# EAGLE design ad (EAGLE 9.3.0)
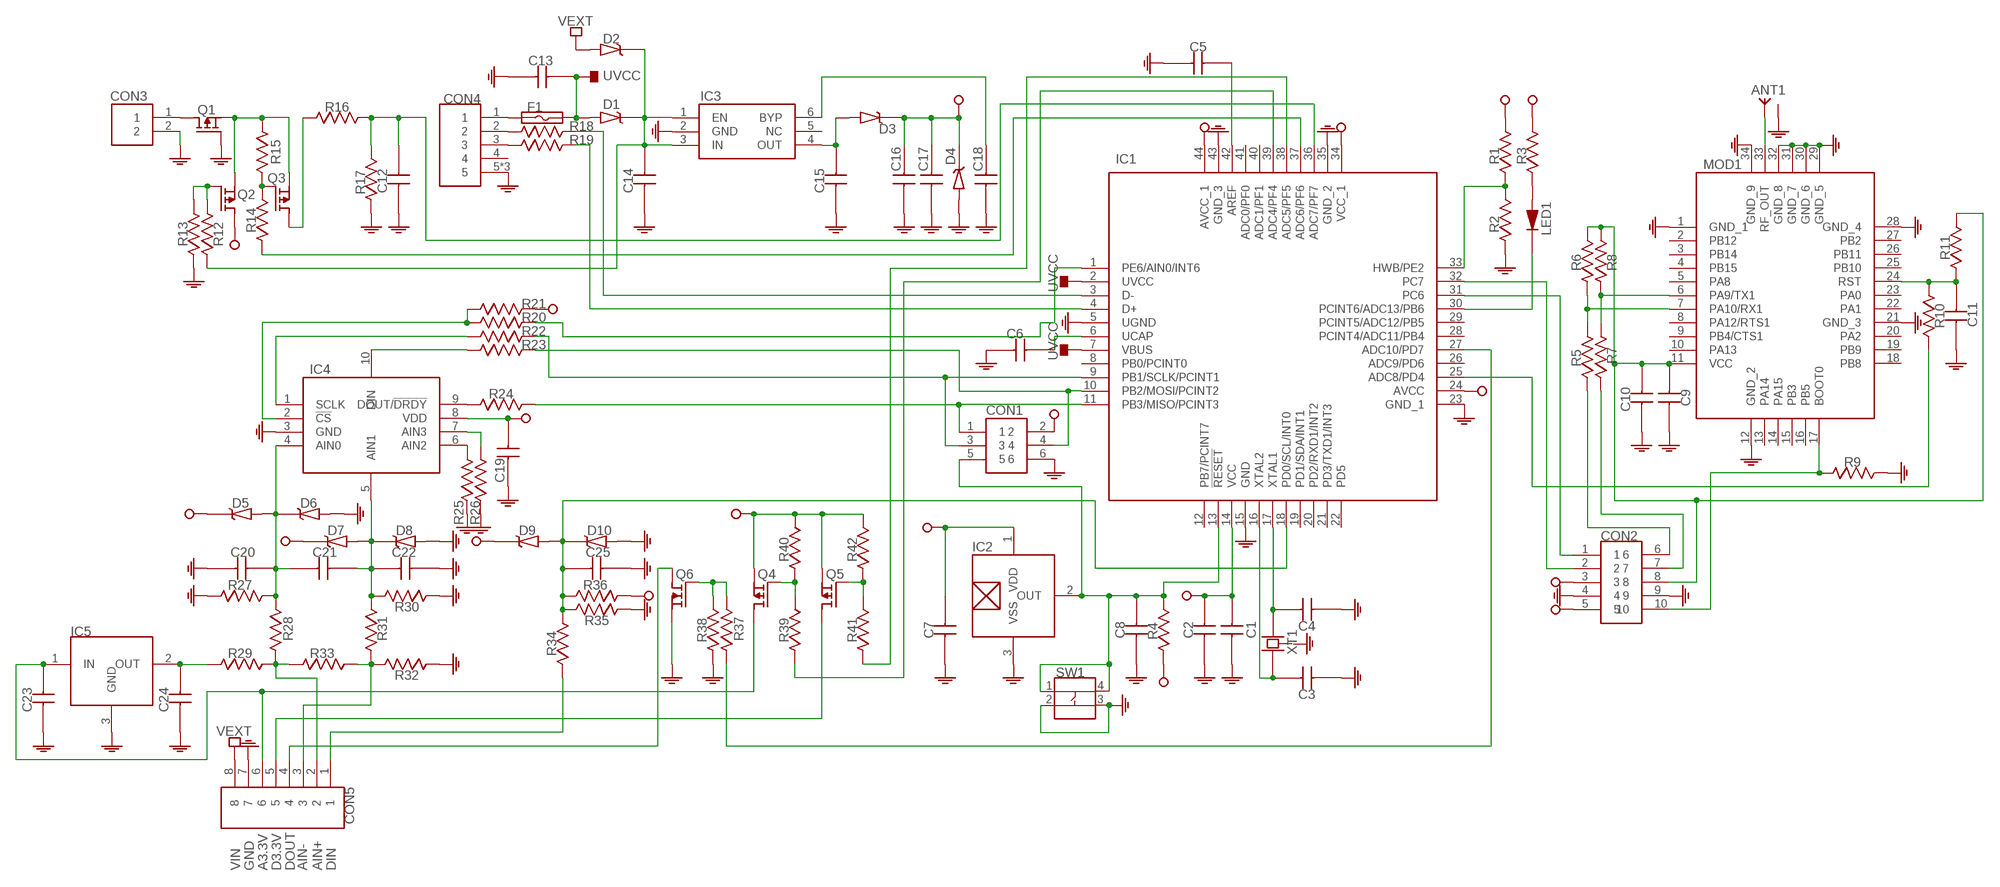
[diagram p0: schematic, sheet 1]

## Parts
ANT1  SMA-RF  [SMA-RF]
C1  CAPACITOR-0603  [0603]
C2  CAPACITOR-0603  [0603]
C3  CAPACITOR-0603  [0603]
C4  CAPACITOR-0603  [0603]
C5  CAPACITOR-0603  [0603]
C6  CAPACITOR-0603  [0603]
C7  CAPACITOR-0603  [0603]
C8  CAPACITOR-0603  [0603]
C9  CAPACITOR-0603  [0603]
C10  CAPACITOR-0603  [0603]
C11  CAPACITOR-0603  [0603]
C12  CAPACITOR-0603  [0603]
C13  CAPACITOR-0603  [0603]
C14  CAPACITOR-0805  [0805]
C15  CAPACITOR-0805  [0805]
C16  CAPACITOR-0603  [0603]
C17  CAPACITOR-0603  [0603]
C18  CAPACITOR-0603  [0603]
C19  CAPACITOR-0603  [0603]
C20  CAPACITOR-0603  [0603]
C21  CAPACITOR-0603  [0603]
C22  CAPACITOR-0603  [0603]
C23  CAPACITOR-0603  [0603]
C24  CAPACITOR-0603  [0603]
C25  CAPACITOR-0603  [0603]
CON1  ISP  [ISP]
CON2  HEADER-10P-2R-DIP-2_54MM  [HEADER-10P-2R-DIP-2_54MM]
CON3  JST-PH-2-2.0MM  [JST-PH-2-2.0MM]
CON4  USB-MICRO-DIP-VER  [USB-MICRO-DIP-VER]
CON5  CON-3_50MM-8P-1985250  [CON-3_50MM-8P-1985250]
D1  DIODE-SCHOTTKY  [SOD123-DIODE]
D2  DIODE-SCHOTTKY  [SOD123-DIODE]
D3  DIODE-SCHOTTKY  [SOD123-DIODE]
D4  ZENER-SOD123  [SOD123-DIODE]
D5  DIODE-SCHOTTKY  [SOD123-DIODE]
D6  DIODE-SCHOTTKY  [SOD123-DIODE]
D7  DIODE-SCHOTTKY  [SOD123-DIODE]
D8  DIODE-SCHOTTKY  [SOD123-DIODE]
D9  DIODE-SCHOTTKY  [SOD123-DIODE]
D10  DIODE-SCHOTTKY  [SOD123-DIODE]
F1  FUSE-0805  [0805]
IC1  ATMEGA32U4-MU  [QFN-44]
IC2  S-5712-SOT23-3  [SOT23-3]
IC3  MIC5219-VDFN-6  [VDFN-6]
IC4  ADS1118IRUGT  [X2QFN-10]
IC5  VREF-SOT23-3  [SOT23-3]
LED1  LED-0603  [LED-0603]
MOD1  RAK811  [RAK811]
Q1  P-MOSFET  [SOT23-3]
Q2  P-MOSFET  [SOT23-3]
Q3  P-MOSFET  [SOT23-3]
Q4  P-MOSFET  [SOT23-3]
Q5  P-MOSFET  [SOT23-3]
Q6  N-MOSFET  [SOT23-3]
R1  RESISTOR-0603  [0603]
R2  RESISTOR-0603  [0603]
R3  RESISTOR-0603  [0603]
R4  RESISTOR-0603  [0603]
R5  RESISTOR-0603  [0603]
R6  RESISTOR-0603  [0603]
R7  RESISTOR-0603  [0603]
R8  RESISTOR-0603  [0603]
R9  RESISTOR-0603  [0603]
R10  RESISTOR-0603  [0603]
R11  RESISTOR-0603  [0603]
R12  RESISTOR-0603  [0603]
R13  RESISTOR-0603  [0603]
R14  RESISTOR-0603  [0603]
R15  RESISTOR-0603  [0603]
R16  RESISTOR-0603  [0603]
R17  RESISTOR-0603  [0603]
R18  RESISTOR-0603  [0603]
R19  RESISTOR-0603  [0603]
R20  RESISTOR-0603  [0603]
R21  RESISTOR-0603  [0603]
R22  RESISTOR-0603  [0603]
R23  RESISTOR-0603  [0603]
R24  RESISTOR-0603  [0603]
R25  RESISTOR-0603  [0603]
R26  RESISTOR-0603  [0603]
R27  RESISTOR-JMP-2_54MM  [HEADER-2P-DIP-2_54MM]
R28  RESISTOR-JMP-2_54MM  [HEADER-2P-DIP-2_54MM]
R29  RESISTOR-JMP-2_54MM  [HEADER-2P-DIP-2_54MM]
R30  RESISTOR-JMP-2_54MM  [HEADER-2P-DIP-2_54MM]
R31  RESISTOR-JMP-2_54MM  [HEADER-2P-DIP-2_54MM]
R32  RESISTOR-JMP-2_54MM  [HEADER-2P-DIP-2_54MM]
R33  RESISTOR-JMP-2_54MM  [HEADER-2P-DIP-2_54MM]
R34  RESISTOR-JMP-2_54MM  [HEADER-2P-DIP-2_54MM]
R35  RESISTOR-JMP-2_54MM  [HEADER-2P-DIP-2_54MM]
R36  RESISTOR-JMP-2_54MM  [HEADER-2P-DIP-2_54MM]
R37  RESISTOR-0603  [0603]
R38  RESISTOR-0603  [0603]
R39  RESISTOR-0603  [0603]
R40  RESISTOR-0603  [0603]
R41  RESISTOR-0603  [0603]
R42  RESISTOR-0603  [0603]
SW1  BUTTON-4P-SMD-5X5  [BUTTON-4P-SMD-5X5]
XT1  CRYSTAL-5032-4P  [CRYSTAL-5032-4P]

## Nets
GND: ANT1.2(GND) ANT1.3(GND) ANT1.4(GND) ANT1.5(GND) C1.1 C2.1 C3.1 C4.1 C5.1 C6.1 C7.1 C8.1 C9.1 C10.1 C11.1 C12.1 C13.1 C14.1 C15.1 C16.1 C17.1 C18.1 C19.1 C20.1 C22.2 C23.1 C24.1 C25.2 CON1.6 CON2.4 CON2.9 CON3.2 CON4.5 CON4.6 CON4.7 CON5.7 D4.2(A) D6.2(A) D8.2(A) D10.2(A) IC1.5(UGND) IC1.15(GND) IC1.23(GND_1) IC1.35(GND_2) IC1.43(GND_3) IC2.3(VSS) IC3.2(GND) IC4.3(GND) IC5.3(GND) MOD1.1(GND_1) MOD1.12(GND_2) MOD1.21(GND_3) MOD1.28(GND_4) MOD1.29(GND_5) MOD1.30(GND_6) MOD1.31(GND_7) MOD1.32(GND_8) MOD1.34(GND_9) Q1.1(G) Q6.2(S) R2.1 R9.2 R13.1 R17.1 R25.1 R26.1 R27.1 R30.1 R32.1 R35.1 R38.1 SW1.2 SW1.3
N$1: IC4.1(SCLK) R22.2
N$2: C11.2 MOD1.24(RST) R10.1 R11.1
N$3: CON1.1 IC1.11(PB3/MISO/PCINT3) R24.2
N$4: ANT1.1(ANT) MOD1.33(RF_OUT)
N$6: MOD1.7(PA10/RX1) R5.2 R6.1
N$7: MOD1.6(PA9/TX1) R7.2 R8.1
N$8: IC4.2(!CS) R20.2 R21.1
N$9: CON1.4 IC1.10(PB2/MOSI/PCINT2) R23.2
N$10: C3.2 IC1.16(XTAL2) XT1.1
N$11: CON2.1 IC1.31(PC6)
N$12: C4.2 IC1.17(XTAL1) XT1.3
N$13: C9.2 C10.2 CON2.8 MOD1.11(VCC) R6.2 R8.2 R11.2
N$14: CON2.7 R7.1
N$15: Q6.1(G) R37.2 R38.2
N$16: IC1.25(ADC8/PD4) R10.2
N$17: IC4.10(DIN) R23.1
N$18: IC4.9(DOUT/!DRDY) R24.1
N$19: IC1.30(PCINT6/ADC13/PB6) LED1.1(K)
N$20: CON5.2 R28.2 R29.2 R33.1
N$21: CON5.3 R31.2 R32.2 R33.2
N$22: C25.1 D9.2(A) D10.1(K) IC1.18(PD0/SCL/INT0) R34.2 R35.2 R36.2
N$23: C21.2 C22.1 D7.2(A) D8.1(K) IC4.5(AIN1) R30.2 R31.1
N$24: C20.2 C21.1 D5.2(A) D6.1(K) IC4.4(AIN0) R27.2 R28.1
N$25: CON5.4 Q6.3(D)
N$26: IC1.27(ADC10/PD7) R37.1
N$27: CON5.5 Q5.3(D)
N$28: Q5.1(G) R41.2 R42.1
N$29: CON2.2 IC1.32(PC7)
N$30: IC4.6(AIN2) R25.2
N$31: C5.2 IC1.42(AREF)
N$32: Q3.1(G) R14.2 R15.2
N$33: CON4.1 F1.1
N$34: C6.2 IC1.6(UCAP)
N$35: LED1.2(A) R3.1
N$36: C12.2 IC1.36(ADC7/PF7) R16.2 R17.2
N$37: C18.2 IC3.6(BYP)
N$38: C14.2 D1.1(K) D2.1(K) IC3.1(EN) IC3.3(IN) R12.1
N$40: C15.2 D3.2(A) IC3.4(OUT)
N$41: CON4.2 R18.1
N$42: CON4.3 R19.1
N$43: IC1.3(D-) R18.2
N$44: IC1.4(D+) R19.2
N$45: CON1.3 IC1.9(PB1/SCLK/PCINT1) R22.1
N$46: Q4.1(G) R39.2 R40.1
N$47: IC1.37(ADC6/PF6) R14.1
N$48: IC1.1(PE6/AIN0/INT6) R20.1
N$50: IC1.38(ADC5/PF5) R41.1
N$51: IC1.39(ADC4/PF4) R39.1
N$52: CON5.1 R34.1
N$53: Q2.1(G) R12.2 R13.2
N$54: IC4.7(AIN3) R26.2
N$55: CON3.1 Q1.3(D)
N$56: C24.2 IC5.2(OUT) R29.1
N$57: C23.2 CON5.6 IC5.1(IN) Q4.3(D)
N$58: Q1.2(S) Q2.2(S) Q3.2(S) R15.1
N$59: Q3.3(D) R16.1
N$60: CON2.6 R5.1
N$61: IC1.33(HWB/PE2) R1.1 R2.2
N$63: CON2.10 MOD1.17(BOOT0) R9.1
N$64: C8.2 CON1.5 IC1.13(!RESET) IC2.2(OUT) R4.2 SW1.1 SW1.4
UVCC: C13.2 D1.2(A) F1.2 IC1.2(UVCC) IC1.7(VBUS)
VCC: C1.2 C2.2 C7.2 C16.2 C17.2 C19.2 CON1.2 CON2.3 CON2.5 D3.1(K) D4.1(K) D5.1(K) D7.1(K) D9.1(K) IC1.14(VCC) IC1.24(AVCC) IC1.34(VCC_1) IC1.44(AVCC_1) IC2.1(VDD) IC4.8(VDD) Q2.3(D) Q4.2(S) Q5.2(S) R1.2 R3.2 R4.1 R21.2 R36.1 R40.2 R42.2
VEXT: CON5.8 D2.2(A)
Unconnected: CON4.4 IC1.8(PB0/PCINT0) IC1.12(PB7/PCINT7) IC1.19(PD1/SDA/INT1) IC1.20(PD2/RXD1/INT2) IC1.21(PD3/TXD1/INT3) IC1.22(PD5) IC1.26(ADC9/PD6) IC1.28(PCINT4/ADC11/PB4) IC1.29(PCINT5/ADC12/PB5) IC1.40(ADC1/PF1) IC1.41(ADC0/PF0) IC3.5(NC) MOD1.2(PB12) MOD1.3(PB14) MOD1.4(PB15) MOD1.5(PA8) MOD1.8(PA12/RTS1) MOD1.9(PB4/CTS1) MOD1.10(PA13) MOD1.13(PA14) MOD1.14(PA15) MOD1.15(PB3) MOD1.16(PB5) MOD1.18(PB8) MOD1.19(PB9) MOD1.20(PA2) MOD1.22(PA1) MOD1.23(PA0) MOD1.25(PB10) MOD1.26(PB11) MOD1.27(PB2)

## Notes on the sheet
- VIN | GND | A3.3V | D3.3V | DOUT | AIN- | AIN+ | DIN

## Power pins joined to a net without a drawn wire
GND: XT1.2(GND) XT1.4(GND)

## Library data of the parts
ANT1 = SamacSys_Parts:SMA-RF
C1-C13 C16-C25 = SamacSys_Parts:CAPACITOR-0603
C14 C15 = SamacSys_Parts:CAPACITOR-0805
CON1 = SamacSys_Parts:ISP
CON2 = SamacSys_Parts:HEADER-10P-2R-DIP-2_54MM
CON3 = SamacSys_Parts:JST-PH-2-2.0MM
CON4 = SamacSys_Parts:USB-MICRO-DIP-VER
CON5 = SamacSys_Parts:CON-3_50MM-8P-1985250
D1-D3 D5-D10 = SamacSys_Parts:DIODE-SCHOTTKY
D4 = SamacSys_Parts:ZENER-SOD123
F1 = SamacSys_Parts:FUSE-0805
IC1 = SamacSys_Parts:ATMEGA32U4-MU
IC2 = SamacSys_Parts:S-5712-SOT23-3
IC3 = SamacSys_Parts:MIC5219-VDFN-6
IC4 = SamacSys_Parts:ADS1118IRUGT
IC5 = SamacSys_Parts:VREF-SOT23-3
LED1 = SamacSys_Parts:LED-0603
MOD1 = SamacSys_Parts:RAK811
Q1-Q5 = SamacSys_Parts:P-MOSFET
Q6 = SamacSys_Parts:N-MOSFET
R1-R26 R37-R42 = SamacSys_Parts:RESISTOR-0603
R27-R36 = SamacSys_Parts:RESISTOR-JMP-2_54MM
SW1 = SamacSys_Parts:BUTTON-4P-SMD-5X5
XT1 = SamacSys_Parts:CRYSTAL-5032-4P

## Board
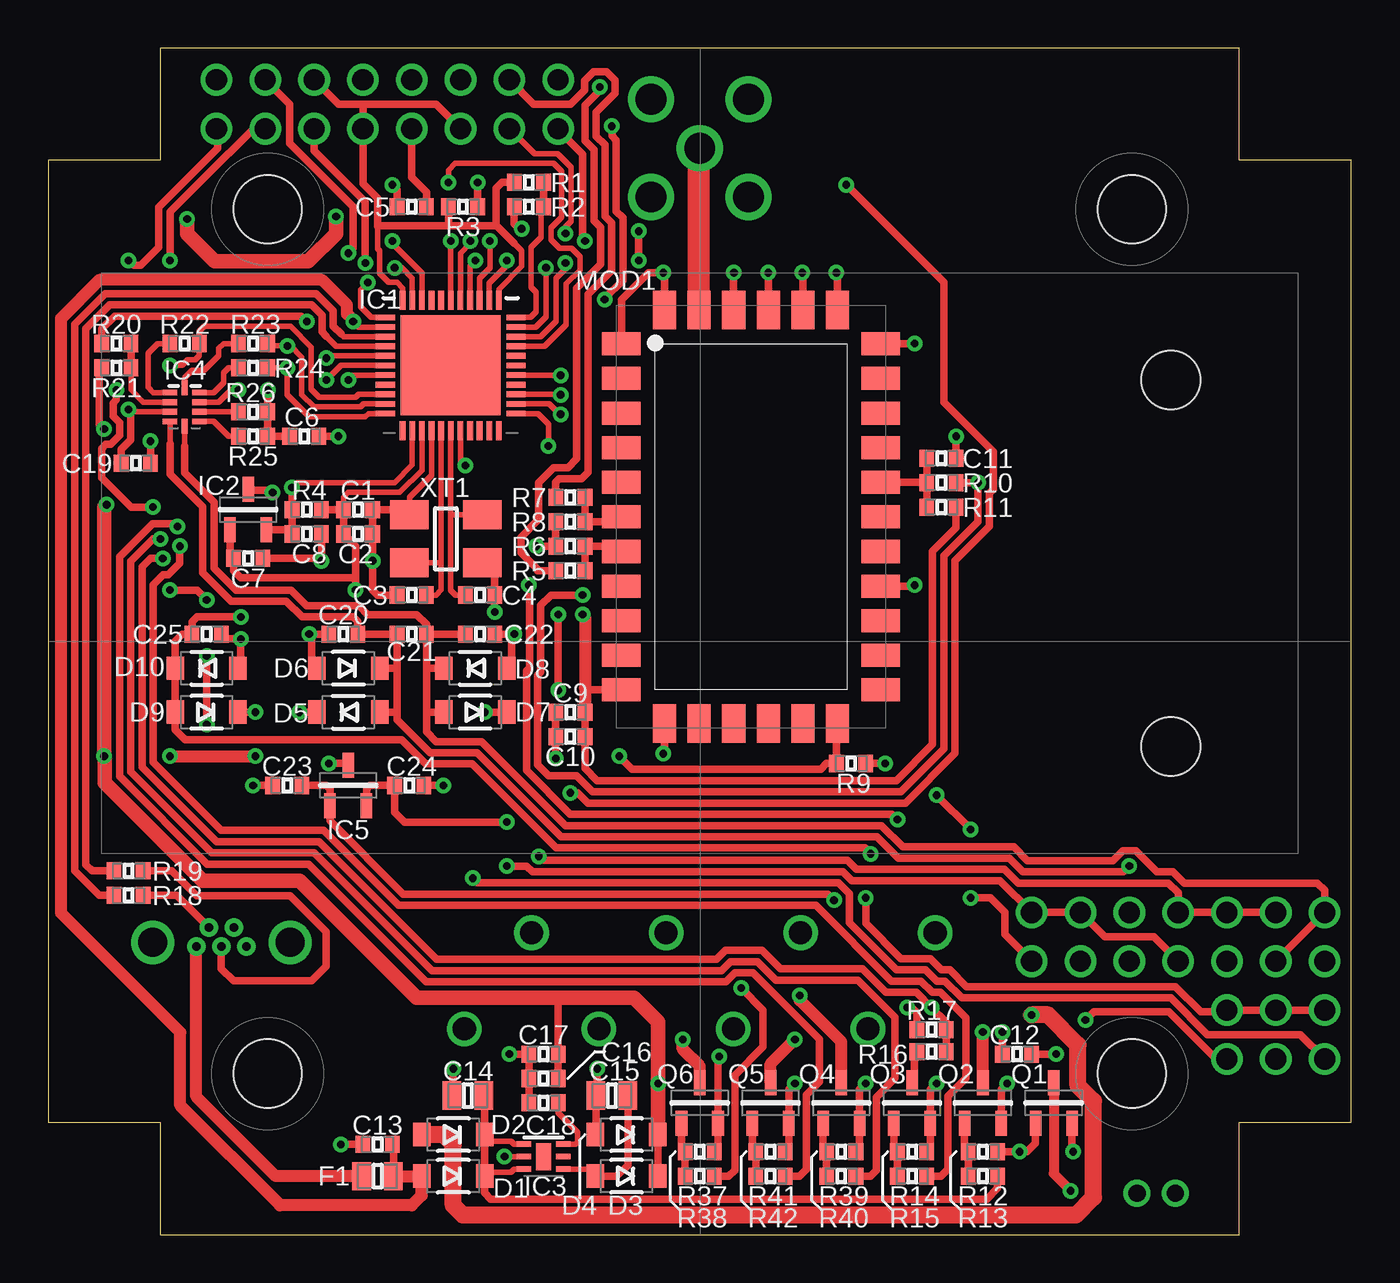
[diagram p1: board, top side]
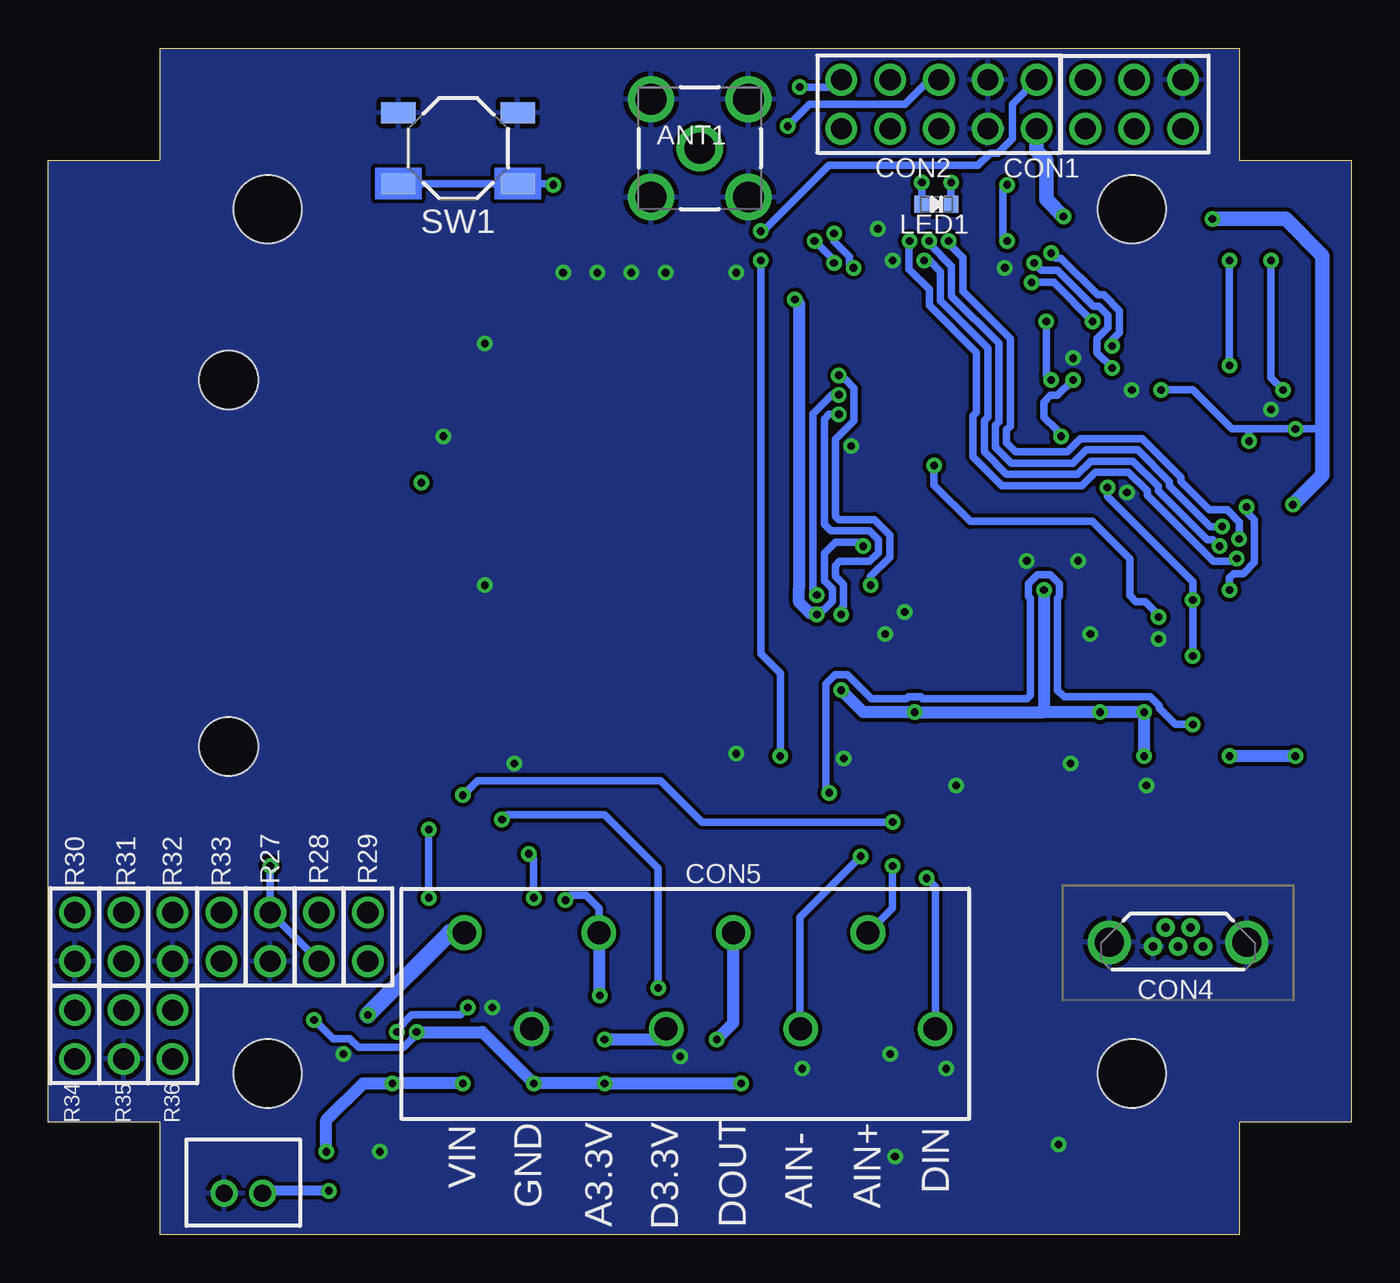
[diagram p2: board, bottom side, seen from below]

Size 67.82 x 61.72 mm. Coordinates in mm from the lower left corner, seen from the top.
Outline: 0,5.84 5.84,5.84 5.84,0 61.98,0 61.98,5.84 67.82,5.84 67.82,55.88 61.98,55.88 61.98,61.72 5.84,61.72 5.84,55.88 0,55.88 0,5.84
Copper layers (1*16): Top 0.035mm / dielectric 1.5mm / Bottom 0.035mm
Design rules "qfn": minimum track width 10mil, minimum drill 0.4mm, track to track 8mil, track to pad 10mil, pad to pad 8mil, via to via 8mil, smd to smd 0mil, copper to edge 0mil, drill to drill 6mil, minimum pad ring 10mil, minimum via ring 8mil, stop-mask expansion 4mil, vias tented up to drill 25mil, thermal gap 10mil
Holes 3.56 mm at 11.43,8.38 56.39,8.38 56.39,53.34 11.43,53.34
Holes 3.05 mm at 58.42,44.45 58.42,25.4
bRestrict: area 21.3,52.8 to 21.8,55

### Footprints (pad centres in the part's own frame; a part is rotated, then mirrored left to right if it is on the bottom)
SMA-RF = drill 1.6: 1 0,0; 2 -2.54,2.54; 3 -2.54,-2.54; 4 2.54,-2.54; 5 2.54,2.54
0603 = smd 0.762 x 0.889: 1 -0.762,0; 2 0.762,0
0805 = smd 0.97 x 1.47: 1 -0.83,0; 2 0.83,0
ISP = drill 1.1 pad 1.65: 1 0,0; 2 2.54,0; 3 0,-2.54; 4 2.54,-2.54; 5 0,-5.08; 6 2.54,-5.08
HEADER-10P-2R-DIP-2_54MM = drill 1.1 pad 1.65: 1 0,0; 2 2.54,0; 3 5.08,0; 4 7.62,0; 5 10.16,0; 6 0,2.54; 7 2.54,2.54; 8 5.08,2.54; 9 7.62,2.54; 10 10.16,2.54
JST-PH-2-2.0MM = drill 0.9: 1 -1,0; 2 1,0
USB-MICRO-DIP-VER = drill 0.45: 1 -1.3,0; 2 -0.65,-1; 3 0,0; 4 0.65,-1; 5 1.3,0 | drill 1.5: 6 -3.575,-0.22; 7 3.575,-0.22
CON-3_50MM-8P-1985250 = drill 1.2: 1 12.25,-2.5; 2 8.75,2.5; 3 5.25,-2.5; 4 1.75,2.5; 5 -1.75,-2.5; 6 -5.25,2.5; 7 -8.75,-2.5; 8 -12.25,2.5
SOD123-DIODE = smd 0.91 x 1.22: 1 -1.635,0; 2 1.635,0
QFN-44 = smd 1 x 0.3: 1 -3.4,2.5; 2 -3.4,2; 3 -3.4,1.5; 4 -3.4,1; 5 -3.4,0.5; 6 -3.4,0; 7 -3.4,-0.5; 8 -3.4,-1; 9 -3.4,-1.5; 10 -3.4,-2; 11 -3.4,-2.5; 23 3.4,-2.5; 24 3.4,-2; 25 3.4,-1.5; 26 3.4,-1; 27 3.4,-0.5; 28 3.4,0; 29 3.4,0.5; 30 3.4,1; 31 3.4,1.5; 32 3.4,2; 33 3.4,2.5 | smd 0.3 x 1: 12 -2.5,-3.4; 13 -2,-3.4; 14 -1.5,-3.4; 15 -1,-3.4; 16 -0.5,-3.4; 17 0,-3.4; 18 0.5,-3.4; 19 1,-3.4; 20 1.5,-3.4; 21 2,-3.4; 22 2.5,-3.4; 34 2.5,3.4; 35 2,3.4; 36 1.5,3.4; 37 1,3.4; 38 0.5,3.4; 39 0,3.4; 40 -0.5,3.4; 41 -1,3.4; 42 -1.5,3.4; 43 -2,3.4; 44 -2.5,3.4 | smd 5.2 x 5.2: 45 0,0
SOT23-3 = smd 1.3 x 0.6: 1 -1.05,0.95; 2 -1.05,-0.95; 3 1.05,0
VDFN-6 = smd 0.75 x 0.3: 1 -1.025,0.65; 2 -1.025,0; 3 -1.025,-0.65; 4 1.025,-0.65; 5 1.025,0; 6 1.025,0.65 | smd 0.8 x 1.4: 7 0,0
X2QFN-10 = smd 0.75 x 0.3: 1 -0.775,0.75; 2 -0.775,0.25; 3 -0.775,-0.25; 4 -0.775,-0.75; 6 0.775,-0.75; 7 0.775,-0.25; 8 0.775,0.25; 9 0.775,0.75 | smd 0.3 x 0.8: 5 0,-1; 10 0,1
LED-0603 = smd 0.762 x 0.889: 1 -0.762,0; 2 0.762,0
RAK811 = smd 2 x 1.2: 1 -6.75,9; 2 -6.75,7.2; 3 -6.75,5.4; 4 -6.75,3.6; 5 -6.75,1.8; 6 -6.75,0; 7 -6.75,-1.8; 8 -6.75,-3.6; 9 -6.75,-5.4; 10 -6.75,-7.2; 11 -6.75,-9; 18 6.75,-9; 19 6.75,-7.2; 20 6.75,-5.4; 21 6.75,-3.6; 22 6.75,-1.8; 23 6.75,0; 24 6.75,1.8; 25 6.75,3.6; 26 6.75,5.4; 27 6.75,7.2; 28 6.75,9 | smd 1.2 x 2: 12 -4.5,-10.75; 13 -2.7,-10.75; 14 -0.9,-10.75; 15 0.9,-10.75; 16 2.7,-10.75; 17 4.5,-10.75; 29 4.5,10.75; 30 2.7,10.75; 31 0.9,10.75; 32 -0.9,10.75; 33 -2.7,10.75; 34 -4.5,10.75
HEADER-2P-DIP-2_54MM = drill 1.1 pad 1.65: 1 0,-1.27; 2 0,1.27
BUTTON-4P-SMD-5X5 = smd 1.8 x 1.1: 1 -3.1,1.85; 2 -3.1,-1.85; 3 3.1,-1.85; 4 3.1,1.85
CRYSTAL-5032-4P = smd 2 x 1.5: 1 -1.9,-1.25; 2 1.9,-1.25; 3 1.9,1.25; 4 -1.9,1.25

### Placement (x,y rotation side)
ANT1  33.91,56.52 0 bottom
C1  16.13,37.72 180 top
C2  16.13,36.45 180 top
C3  18.92,33.27 0 top
C4  22.48,33.27 180 top
C5  18.92,53.47 180 top
C6  13.34,41.53 0 top
C7  10.41,35.18 180 top
C8  13.46,36.45 180 top
C9  27.18,27.18 0 top
C10  27.18,25.91 0 top
C11  46.48,40.39 180 top
C12  50.42,9.4 180 top
C13  17.14,4.7 0 top
C14  21.84,7.24 0 top
C15  29.34,7.24 0 top
C16  25.78,8.13 0 top
C17  25.78,9.4 0 top
C18  25.78,6.86 0 top
C19  4.57,40.13 0 top
C20  15.37,31.24 0 top
C21  18.92,31.24 0 top
C22  22.48,31.24 0 top
C23  12.45,23.37 0 top
C24  18.8,23.37 180 top
C25  8.26,31.24 0 top
CON1  13.84,57.53 90 bottom
CON2  26.54,57.53 0 bottom
CON3  57.66,2.16 180 bottom
CON4  9.02,14.99 180 bottom
CON5  33.91,13.21 0 bottom
D1  21.08,3.05 180 top
D2  21.08,5.21 180 top
D3  30.1,3.05 180 top
D4  30.1,5.21 180 top
D5  15.62,27.18 0 top
D6  15.62,29.46 180 top
D7  22.23,27.18 180 top
D8  22.23,29.46 0 top
D9  8.26,27.18 180 top
D10  8.26,29.46 0 top
F1  17.14,3.05 0 top
IC1  20.95,45.21 0 top
IC2  10.41,37.72 90 top
IC3  25.78,4.06 0 top
IC4  7.11,43.05 0 top
IC5  15.62,23.37 90 top
LED1  21.59,53.59 180 bottom
MOD1  36.58,37.34 0 top
Q1  52.32,6.86 90 top
Q2  48.64,6.86 90 top
Q3  44.96,6.86 90 top
Q4  41.27,6.86 90 top
Q5  37.59,6.86 90 top
Q6  33.91,6.86 90 top
R1  25.02,54.74 180 top
R2  25.02,53.47 0 top
R3  21.59,53.47 180 top
R4  13.46,37.72 180 top
R5  27.18,34.54 0 top
R6  27.18,35.81 180 top
R7  27.18,38.35 0 top
R8  27.18,37.08 180 top
R9  41.78,24.51 0 top
R10  46.48,39.12 0 top
R11  46.48,37.85 0 top
R12  48.64,3.05 180 top
R13  48.64,4.32 180 top
R14  44.96,3.05 180 top
R15  44.96,4.32 180 top
R16  45.97,9.53 0 top
R17  45.97,10.67 0 top
R18  4.19,17.65 180 top
R19  4.19,18.92 180 top
R20  3.56,46.35 0 top
R21  3.56,45.09 180 top
R22  7.11,46.35 180 top
R23  10.67,46.35 0 top
R24  10.67,45.09 0 top
R25  10.67,41.53 180 top
R26  10.67,42.8 180 top
R27  56.26,15.49 0 bottom
R28  53.72,15.49 0 bottom
R29  51.18,15.49 0 bottom
R30  66.42,15.49 0 bottom
R31  63.88,15.49 0 bottom
R32  61.34,15.49 0 bottom
R33  58.8,15.49 0 bottom
R34  66.42,10.41 0 bottom
R35  63.88,10.41 0 bottom
R36  61.34,10.41 0 bottom
R37  33.91,3.05 180 top
R38  33.91,4.32 180 top
R39  41.27,3.05 180 top
R40  41.27,4.32 0 top
R41  37.59,3.05 180 top
R42  37.59,4.32 0 top
SW1  46.48,56.52 180 bottom
XT1  20.7,36.2 0 top

### Tracks (layer width: path | path; a pad name or v marks a point on that pad's centre or on a via)
GND  (via drill 0.4)
  Top 0.292: IC3.2 v23.75,4.06 | IC1.15 19.95,39.51 18.8,38.36 18.8,37.72 XT1.4 | IC4.3 4.31,42.8 v4.19,42.93 | IC1.5 14.6,45.71 v14.48,45.59 | IC1.35 22.95,49.5 23.88,50.42 v23.88,50.67 | IC1.43 18.95,49.75 18.41,50.29 v18.03,50.29 | IC1.23 25.49,42.71 26.04,42.16 v26.04,41.02
  Top 0.381: D4.2 28.51,5.25 C15.1 28.57,7.31 v28.57,8.64 | C18.1 C16.1 C17.1 v24,9.4 | C14.1 21.08,7.31 v21.08,8.64 | R13.1 v50.55,4.32 50.93,4.32 51.37,4.76 Q1.1 | R38.1 34.86,4.51 Q6.2 34.86,9.21 v34.92,9.27 | C25.2 9.27,30.99 v10.03,30.99 10.03,29.61 D10.2 | C20.1 v13.59,31.24 13.72,31.11 13.72,29.73 D6.2 | C22.2 v24.26,31.24 24.13,31.11 24.13,29.73 D8.2 | XT1.2 22.91,35.26 23.24,34.92 C4.1 v23.24,32.38 | 18.8,37.72 C1.1 C2.1 v16.89,35.05 16.89,33.53 17.14,33.27 C3.1 | C8.1 v14.22,35.05 14.1,35.18 C7.1 | MOD1.34 32.08,49.97 v32,50.04 31.24,50.04 29.83,48.62 MOD1.1 | MOD1.32 35.68,50.03 v35.69,50.04 | MOD1.31 37.48,50.03 v37.47,50.04 | MOD1.30 39.28,50.01 v39.24,50.04 | MOD1.29 41.08,49.98 v41.02,50.04 | MOD1.28 45.07,46.34 v45.09,46.35 | MOD1.21 45.04,33.74 v45.09,33.78 | MOD1.12 32.08,25.09 v32,25.02 | v11.43,43.94 R26.1 R25.1 C6.1 | v11.68,38.61 11.56,38.73 10.45,38.73 IC2.3 | C11.1 v47.24,41.53 | C9.1 C10.1 v26.42,24.77 | R9.2 v43.56,24.51 | C5.1 19.68,54.23 18.92,54.99 CON2.4 | R2.1 24.26,52.58 24.51,52.32 v24.64,52.32 | C19.1 3.81,40.85 4.3,41.34 4.3,42.81 v4.19,42.93 | C12.1 v52.45,9.4 | v44.7,11.81 44.96,11.81 45.21,11.56 R17.1 | C23.1 v10.67,23.37 | C24.1 v20.57,23.37 | IC5.3 15.53,24.51 v14.61,24.51 | C13.1 v15.24,4.7
  pour Bottom: 0.13,5.97 0.13,55.75 5.97,55.75 5.97,61.59 61.85,61.59 61.85,55.75 67.69,55.75 67.69,5.97 61.85,5.97 61.85,0.13 5.97,0.13 5.97,5.97
N$1
  Top 0.292: IC4.1 5.47,43.8 5.21,44.07 5.21,45.85 5.71,46.35 R22.2
N$2
  Top 0.381: C11.2 R10.1 | R10.1 R11.1 | MOD1.24 45.7,39.14 R10.1
N$3  (via drill 0.4)
  Top 0.292: R24.2 v12.45,45.09 12.45,43.69 13.59,42.55 16.51,42.55 16.68,42.71 IC1.11
  Top 0.381: CON1.1 13.84,56.39 16.51,53.72 v16.51,50.55
  Bottom 0.381: v12.45,45.09 13.24,45.88 13.24,46.59 12.66,47.17 12.66,47.83 13.13,48.3 13.43,48.3 15.3,50.16 16.13,50.16 v16.51,50.55
N$4
  Top 1.143: MOD1.33 33.88,56.48 ANT1.1
N$6
  Top 0.381: MOD1.7 29.55,35.81 R6.1 R5.2
N$7
  Top 0.381: MOD1.6 29.57,37.08 R8.1 R7.2
N$8
  Top 0.292: IC4.2 4.96,43.3 4.32,43.94 R21.1
  Top 0.381: R20.2 R21.1
N$9  (via drill 0.4)
  Top 0.292: R23.2 11.56,46.23 v12.45,46.23 12.62,46.23 13.2,45.65 13.2,43.7 13.84,43.05 16.26,43.05 16.41,43.21 IC1.10
  Top 0.381: v15.62,51.05 15.88,51.31 15.88,53.47 12.57,56.77 12.57,58.8 CON1.4
  Bottom 0.381: v12.45,46.23 12.45,46.56 12.08,46.93 12.08,48.07 12.89,48.88 13.19,48.88 15.11,50.8 15.37,50.8 v15.62,51.05
N$10
  Top 0.292: IC1.16 20.45,34.92 | 20.45,34.92 20.45,33.54 20.19,33.27 C3.2 | XT1.1 20.43,34.95 20.45,34.92
N$11  (via drill 0.4)
  Top 0.292: IC1.31 25.63,46.71 26.43,47.51 26.43,49.75 26.92,50.24 v26.92,50.55
  Top 0.381: v27.94,51.69 27.94,51.74 27.81,51.86 27.81,56.2 26.54,57.47 CON2.1
  Bottom 0.381: v26.92,50.55 26.92,50.67 v27.94,51.69
N$12
  Top 0.292: C4.2 21.21,33.27 20.95,33.53 20.95,37.47 | IC1.17 20.95,37.47 | XT1.3 20.98,37.45 20.95,37.47
N$13  (via drill 0.4)
  Top 0.381: C9.2 C10.2 27.94,24.26 28.57,23.62 44.13,23.62 46.02,25.52 46.02,35.55 47.24,36.77 R11.2 | R8.2 R6.2 v25.4,35.81 | v28.96,48.64 28.96,48.7 29.91,49.65 29.91,52.88 29.57,53.22 29.57,56.92 29.34,57.15 v29.34,57.66 | MOD1.11 28.05,28.34 27.94,28.45
  Top 0.635: v27.81,32.26 27.94,32.13 27.94,28.45 C9.2
  Bottom 0.381: v29.34,57.66 28.19,58.8 23.24,58.8 21.97,60.07 CON2.8 | v27.81,32.26 27.59,32.48 27.48,32.48 27.02,32.94 27.02,33.6 27.43,34.02 27.43,35.43 26.84,36.03 25.61,36.03 v25.4,35.81
  Bottom 0.635: v27.81,32.26 27.91,32.35 28.2,32.35 28.74,32.89 28.74,33.66 28.73,33.67 28.73,48.41 v28.96,48.64
N$14
  Top 0.381: CON2.7 25.27,58.8 27.18,58.8 27.91,59.53 27.91,60.02 28.37,60.49 29.05,60.49 29.5,60.04 29.5,59.36 28.52,58.38 28.52,57.14 28.98,56.68 28.98,52.98 29.32,52.64 29.32,50.15 28.09,48.92 28.09,39.65 27.76,39.31 26.6,39.31 26.42,39.13 R7.1
N$15
  Top 0.381: Q6.1 32.96,4.51 R38.2 R37.2
N$16  (via drill 0.4)
  Top 0.292: v26.67,43.69 26.65,43.71 IC1.25
  Top 0.381: R10.2 v48.39,39.12 48.39,37.08 46.61,35.31 46.61,25.27 44.37,23.04 28.33,23.04 27.5,23.88 26.05,23.88 25.47,24.46 25.47,29.09 25.64,29.26 25.64,32.75 26.16,33.27 v27.81,33.27
  Bottom 0.381: v27.81,33.27 28.02,33.48 28.02,42.71 27.04,43.69 v26.67,43.69
N$17
  Top 0.292: IC4.10 7.11,44.58 7.49,44.96 8.13,44.96 8.89,45.72 8.89,46.1 9.14,46.35 R23.1
N$18
  Top 0.292: IC4.9 8.62,43.8 9.14,44.32 9.14,44.83 9.4,45.09 R24.1
N$19  (via drill 0.4)
  Top 0.292: IC1.30 25.84,46.21 26.96,47.33 26.96,49.46 27.68,50.17 27.68,50.86 27.23,51.31 26.62,51.31 26.17,51.76 26.17,52.38 26.71,52.92 26.71,55.32 26.32,55.72 21.18,55.72 20.83,55.37 v20.83,54.74
  Bottom 0.381: LED1.1 v20.83,54.74
N$20  (via drill 0.4)
  Top 0.381: R33.1 57.53,15.49 54.99,15.49 R28.2 R29.2 49.53,18.41 41.83,18.41 41.37,18.88 25.2,18.88 24.91,19.18 v23.88,19.18
  Bottom 0.381: v23.88,19.18 23.88,16.99 CON5.2
N$21  (via drill 0.4)
  Top 0.381: v25.53,19.68 25.75,19.46 41.61,19.46 42.07,19 49.77,19 50.48,18.29 58.29,18.29 58.8,17.78 R33.2 R32.2 R31.2
  Bottom 0.381: v25.53,19.68 28.7,16.51 28.7,10.75 CON5.3
N$22  (via drill 0.4)
  Top 0.292: IC1.18 21.45,40.27 v21.72,40.01
  Top 0.381: v10.03,32.13 7.75,32.13 7.49,31.88 C25.1 6.99,31.24 6.62,30.88 D10.1 D9.2 6.62,26.27 7.15,25.75 18.39,25.75 19.65,24.49 22.07,24.49 26.44,20.12 42.49,20.12 v42.8,19.81 | R34.2 R35.2 R36.2 61.25,11.59 59.98,11.59 58.66,12.9 47.79,12.9 46.91,13.78 46.49,13.78 45.9,14.36 44.38,14.36 42.55,16.2 v42.55,17.53
  Bottom 0.381: v10.03,32.13 10.25,32.35 10.25,32.46 10.72,32.93 11.21,32.93 11.53,33.25 11.53,35.16 13.49,37.11 19.84,37.11 21.72,38.99 v21.72,40.01 | v42.55,17.53 42.55,19.56 v42.8,19.81
N$23
  Top 0.292: 7.11,41.02 IC4.5
  Top 0.381: C21.2 19.68,29.46 | 19.68,29.46 19.68,27.18 | D8.1 19.68,29.46 | D7.2 19.68,27.18 | C21.2 C22.1 | 7.11,41.02 7.11,39.62 8.64,38.1 8.64,34.67 9.78,33.53 12.64,33.53 13.45,32.72 16.18,32.72 16.64,32.26 19.18,32.26 19.68,31.75 C21.2 | 19.68,27.18 19.68,26.16 20.19,25.65 22.56,25.65 26.93,21.29 43.37,21.29 44.49,20.17 50.26,20.17 50.97,19.46 55.41,19.46 55.93,19.97 56.59,19.97 57.69,18.87 58.53,18.87 59.12,18.29 66.04,18.29 66.42,17.91 R30.2 R31.1
N$24  (via drill 0.4)
  Top 0.292: IC4.4 6.35,41.15
  Top 0.381: 18.16,29.46 C21.1 C20.2 16.1,31.27 16.1,31.91 15.88,32.13 13.21,32.13 12.39,32.94 9.54,32.94 8.05,34.43 8.05,37.86 6.35,39.56 6.35,41.15 | 18.16,29.46 18.16,27.18 | D6.1 18.16,29.46 | D5.2 18.16,27.18 | 18.16,27.18 18.16,26.8 19.89,25.07 22.32,25.07 26.68,20.7 43.13,20.7 44.25,19.58 50.01,19.58 50.73,18.87 55.96,18.87 v56.26,19.18
  Bottom 0.381: R28.1 R27.2 v56.26,19.18
N$25  (via drill 0.4)
  Top 0.635: Q6.3 33.91,8.76 33.02,9.65 v33.02,10.16
  Bottom 0.635: v33.02,10.16 32.16,11.02 CON5.4
N$26  (via drill 0.4)
  Top 0.292: v26.67,44.7 25.53,44.7 25.52,44.71 IC1.27
  Top 0.381: v25.02,33.78 25.05,33.75 25.05,29.5 24.89,29.33 24.89,24.15 27.17,21.87 43.92,21.87 v44.2,21.59 | v36.07,12.83 37.21,11.68 37.21,9.78 35.73,8.3 35.73,3.36 35.42,3.05 R37.1
  Bottom 0.381: v44.2,21.59 43.94,21.84 38.86,21.84 36.07,19.05 v36.07,12.83 | v26.67,44.7 26.45,44.48 26.34,44.48 25.87,44.02 25.87,42.34 26.85,41.37 26.85,37.37 26.67,37.2 24.83,37.2 24.02,36.39 24.02,35.24 25.02,34.24 v25.02,33.78
N$27  (via drill 0.4)
  Top 0.635: Q5.3 37.59,8.89 v38.86,10.16
  Bottom 0.635: v38.86,10.16 36.08,10.16 35.66,10.58 CON5.5
N$28
  Top 0.381: Q5.1 36.64,4.51 R42.1 R41.2
N$29  (via drill 0.4)
  Top 0.292: IC1.32 25.37,47.21 25.91,47.75 v25.91,50.29 | v26.92,52.07 26.92,52.43 27.21,52.72 27.21,55.53 26.52,56.22 25.32,56.22 CON2.2
  Bottom 0.381: v25.91,50.29 26.13,50.51 26.13,50.88 26.92,51.67 v26.92,52.07
N$30
  Top 0.292: IC4.6 8.62,42.3 9.4,41.53 R25.2
N$31  (via drill 0.4)
  Top 0.292: IC1.42 19.45,50.01 17.91,51.56 v17.91,51.69
  Top 0.381: v17.91,54.61 18.16,54.36 C5.2
  Bottom 0.381: v17.91,51.69 18.13,51.91 18.13,54.39 v17.91,54.61
N$32
  Top 0.381: R14.2 R15.2 44.01,4.51 Q3.1
N$33
  Top 0.635: F1.1 11.85,3.05 7.72,7.18 CON4.1
N$34  (via drill 0.4)
  Top 0.292: IC1.6 15.24,45.21 v14.48,44.45
  Top 0.381: C6.2 v15.11,41.53
  Bottom 0.381: v15.11,41.53 15.33,41.75 15.33,41.86 16,42.53 16,43.31 15.66,43.65 15.29,43.65 14.49,44.45 v14.48,44.45
N$35  (via drill 0.4)
  Top 0.381: R3.1 v22.35,54.74
  Bottom 0.381: LED1.2 v22.35,54.74
N$36  (via drill 0.4)
  Top 0.292: IC1.36 22.45,49.76 22.99,50.29 v22.99,51.69
  Top 0.381: R16.2 R17.2 46.74,11.05 v45.97,11.81 45.18,12.61 43.59,12.61 42.37,13.83 38.12,13.83 37.15,14.79 35.25,14.79 34.79,14.33 20.22,14.33 14.1,20.45 8.77,20.45 4.89,24.32 4.89,34.73 5.33,35.18 v5.97,35.18 | C12.2 v49.66,10.54
  Bottom 0.381: v5.97,35.18 6.13,35.02 7.19,35.02 10.63,38.46 10.63,38.68 11.61,39.66 13.32,39.66 14.02,38.96 18.18,38.96 19.7,40.47 19.7,42.59 19.51,42.77 19.51,45.87 21.97,48.34 21.97,49.16 23.02,50.22 23.02,51.65 v22.99,51.69 | v49.66,10.54 49.66,10.67 48.9,11.43 46.35,11.43 v45.97,11.81
N$37
  Top 0.292: IC3.6 27.45,4.71 27.56,4.83 27.56,5.33 26.54,6.35 C18.2
N$38
  Top 0.292: D1.1 22.93,3.26 24.08,3.26 24.23,3.41 IC3.3 | IC3.1 24.23,4.71 24.08,4.87 23.06,4.87 D2.1
  Top 0.381: C14.2 22.72,7.2 D2.1 D1.1 22.72,2.17 23.04,1.85 27.3,1.85 48.84,1.85 49.4,2.41 R12.1
N$40
  Top 0.292: IC3.4 28.1,3.41 D3.2
  Top 0.381: D3.2 29.59,3.05 30.17,3.62 C15.2
N$41
  Top 0.381: CON4.2 6.7,17.65 R18.1
N$42
  Top 0.381: CON4.3 9.02,13.84 9.65,13.21 13.72,13.21 14.48,13.97 14.48,15.75 12.59,17.64 7.73,17.64 6.45,18.92 R19.1
N$43
  Top 0.292: IC1.3 15.39,46.71 15.24,46.86
  Top 0.381: 15.24,46.86 14.84,47.26 14.84,48.07 13.96,48.95 2.98,48.95 1.38,47.36 1.38,18.94 2.67,17.65 R18.2
N$44
  Top 0.292: IC1.4 15,46.21 14.48,46.74
  Top 0.381: 14.48,46.74 14.26,46.95 14.26,47.83 13.72,48.37 3.22,48.37 1.97,47.12 1.97,19.24 2.29,18.92 R19.2
N$45  (via drill 0.4)
  Top 0.292: v6.35,45.21 6.97,45.21 7.27,45.5 7.65,45.5 7.87,45.73 R22.1 7.87,46.99 8.13,47.24 12.62,47.24 13.69,46.17 13.69,43.96 14.1,43.56 16,43.56 16.15,43.71 IC1.9
  Top 0.381: v6.35,50.67 6.35,53.21 9.4,56.26 9.42,56.26 10.69,57.53 CON1.3
  Bottom 0.381: v6.35,50.67 v6.35,45.21
N$46
  Top 0.381: Q4.1 40.33,4.51 R40.1 R39.2
N$47  (via drill 0.4)
  Top 0.292: IC1.37 21.95,50.4 v22.23,50.67
  Top 0.381: R14.1 46.47,3.05 46.82,3.4 46.82,7.2 47.75,8.13 47.75,11.29 46.43,12.61 46,12.61 45.42,13.19 43.9,13.19 39.96,17.13 18.24,17.13 14.34,21.03 9.01,21.03 5.47,24.57 5.47,33.81 5.99,34.33 6.26,34.33 6.86,34.92 v6.86,35.81
  Bottom 0.381: v6.86,35.81 7.2,36.16 7.5,36.16 10.05,38.7 10.05,38.93 11.37,40.24 13.56,40.24 14.26,39.55 17.94,39.55 19.11,40.72 19.11,42.34 18.92,42.53 18.92,46.11 21.39,48.58 21.39,50.09 21.97,50.67 v22.23,50.67
N$48  (via drill 0.4)
  Top 0.292: IC1.1 16.8,47.71 16.26,48.26 16.26,49.15 v16.64,49.53
  Top 0.381: R20.1 2.79,47.12 3.46,47.78 12.45,47.78 13.18,47.78 v13.46,47.5
  Bottom 0.381: v16.64,49.53 15.49,49.53 v13.46,47.5
N$50  (via drill 0.4)
  Top 0.292: IC1.38 21.45,51.05 21.97,51.56 v21.97,51.69
  Top 0.381: R41.1 39.1,3.05 39.45,3.4 39.45,7.28 40.13,7.96 40.13,10.16 36.67,13.62 35.74,13.62 35.27,13.16 19.67,13.16 13.55,19.28 8.28,19.28 3.72,23.84 3.72,35.27 5.45,36.99 6.55,36.99 6.71,36.83 v6.73,36.83
  Bottom 0.381: v6.73,36.83 7.35,36.83 9.46,38.95 9.46,39.17 11.12,40.83 13.8,40.83 14.5,40.13 17.7,40.13 18.53,40.96 18.53,42.1 18.34,42.29 18.34,46.36 20.8,48.82 20.8,50.38 21.97,51.55 v21.97,51.69
N$51  (via drill 0.4)
  Top 0.292: IC1.39 v20.95,51.69
  Top 0.381: R39.1 42.78,3.05 43.1,3.36 43.1,7.16 44.07,8.13 44.07,11.3 42.13,13.24 37.88,13.24 36.91,14.21 35.5,14.21 35.03,13.74 19.98,13.74 13.86,19.86 8.52,19.86 4.3,24.08 4.3,35.02 5.48,36.2 v5.84,36.2
  Bottom 0.381: v5.84,36.2 5.84,37.07 6.47,37.7 7.39,37.7 8.88,39.19 8.88,39.41 10.88,41.41 14.1,41.41 14.78,40.73 17.48,40.73 17.94,41.2 17.94,41.86 17.75,42.05 17.75,46.6 20.22,49.06 20.22,50.83 20.83,51.44 20.83,51.56 v20.95,51.69
N$52  (via drill 0.4)
  Top 0.381: v22.1,18.54 22.34,18.3 41.12,18.3 41.69,17.73 41.69,16.22 44.14,13.78 45.66,13.78 46.24,13.19 46.67,13.19 47.55,12.32 58.42,12.32 60.33,10.41 65.15,10.41 R34.1
  Bottom 0.381: CON5.1 21.66,18.1 v22.1,18.54
N$53
  Top 0.381: Q2.1 47.69,4.51 R13.2 R12.2
N$54
  Top 0.292: IC4.7 R26.2
N$55  (via drill 0.4)
  Top 0.508: Q1.3 52.32,3.17 v53.21,2.29
  Bottom 0.508: v53.21,2.29 56.53,2.29 CON3.1
N$56  (via drill 0.4)
  Top 0.381: IC5.2 16.57,23.18 16.76,23.37 C24.2 18.03,21.97 18.54,21.46 v23.88,21.46 | R29.1 49.78,15.62 49.78,16.76 49.02,17.53 v48.01,17.53 | v46.23,22.86 v48.01,21.08
  Bottom 0.381: v23.88,21.46 33.78,21.46 35.94,23.62 45.47,23.62 v46.23,22.86 | v48.01,21.08 v48.01,17.53
N$57  (via drill 0.4)
  Top 0.381: v40.89,17.4 40.58,17.71 18.48,17.71 14.67,21.53 IC5.1 14.67,23.18 14.48,23.37 C23.2
  Top 0.635: Q4.3 41.27,10.03 39.12,12.19 v39.12,12.45
  Bottom 0.381: CON5.6 39.16,16.98 39.83,17.65 40.64,17.65 v40.89,17.4
  Bottom 0.635: v39.12,12.45 39.12,15.66 CON5.6
N$58  (via drill 0.4)
  Top 0.381: R15.1 45.91,4.51 Q3.2 45.91,7.55 v46.23,7.87 | Q2.2 49.59,7.55 v49.91,7.87 | v53.34,4.32 53.27,4.38 Q1.2
  Bottom 0.635: v46.23,7.87 v49.91,7.87 51.44,7.87 53.34,5.97 v53.34,4.32
N$59
  Top 0.381: R16.1 45.09,9.4 45.09,8.04 Q3.3
N$60  (via drill 0.4)
  Top 0.381: R5.1 25.47,34.54 25.47,34.62 24.6,35.48 24.6,36.29 25.53,37.21 25.53,39.12 26.31,39.9 27.05,39.9 27.5,40.35 27.5,49.24 28.74,50.47 28.74,52.4 28.4,52.74 28.4,56.44 27.94,56.9 27.94,58.74 28.7,59.5 v28.7,59.69
  Bottom 0.381: v28.7,59.69 26.92,59.69 CON2.6
N$61
  Top 0.292: IC1.33 25.11,47.71 25.4,48.01 25.4,49.02 25.13,49.29 25.13,51.37 25.65,51.9 25.65,53.47 25.78,53.59
  Top 0.381: R1.1 25.78,53.59 R2.2
N$63  (via drill 0.4)
  Top 0.381: MOD1.17 41.02,26.53 R9.1 40.51,24.51 40.22,24.22 30.39,24.22 v29.72,24.89 | v30.73,50.67 v30.73,52.2
  Bottom 0.381: CON2.10 17.65,58.8 17.65,57.01 18.4,56.26 18.8,56.26 19.43,55.63 27.18,55.63 30.61,52.2 v30.73,52.2 | v30.73,50.67 30.73,30.23 29.72,29.21 v29.72,24.89
N$64  (via drill 0.4)
  Top 0.292: IC1.13 18.95,40.04 18.03,39.12 12.95,39.12 v12.7,38.86
  Top 0.381: IC2.2 12.48,36.67 C8.2 R4.2 v12.7,38.86 | v8.26,33.02 7.75,33.53 v6.35,33.53 | v4.19,50.67 4.45,50.42 4.83,50.42 5.77,51.36 5.77,53.45 8.81,56.5 8.81,57.48 CON1.5 | v3.56,43.94 3.56,43.42 3.39,43.26 3.39,42.56 3.72,42.24 3.72,41.58 3.25,41.11 3.01,41.11 2.79,40.89 2.79,39.37 4.32,37.85 v5.46,37.85 | v8.26,30.1 v8.26,26.54 | v41.53,54.61 46.61,49.53 46.61,43.31 49.18,40.73 49.18,38.79 48.97,38.57 48.97,36.84 47.19,35.06 47.19,25.03 44.62,22.45 28.09,22.45 27.56,22.99 v27.18,22.99
  Bottom 0.381: v12.7,38.86 12.7,38.42 8.26,33.98 v8.26,33.02 v8.26,30.1 | v4.19,50.67 4.19,44.58 v3.56,43.94 | v6.35,33.53 6.35,34.16 6.13,34.38 5.64,34.38 5.04,34.98 5.04,37.18 5.46,37.6 v5.46,37.85 | v8.26,26.54 9.15,26.54 10,27.39 10,27.51 10.46,27.98 14.95,27.98 15.29,28.32 15.29,33.11 15.21,33.2 15.21,33.86 15.67,34.33 16.33,34.33 16.8,33.86 16.8,33.2 16.71,33.11 16.71,28.07 16.89,27.89 22.32,27.89 22.4,27.98 23.06,27.98 23.15,27.89 24.98,27.89 26.21,29.12 26.87,29.12 27.34,28.65 27.34,23.15 v27.18,22.99 | SW1.4 SW1.1 41.58,54.66 v41.53,54.61
UVCC  (via drill 0.4)
  Top 0.292: IC1.7 15.88,44.71 v15.62,44.45 | IC1.2 16.16,47.21 v15.88,47.5
  Top 0.381: C13.2 17.98,4.63 F1.2
  Top 0.635: F1.2 D1.2 19.45,2.05 18.92,1.52 12.06,1.52 6.88,6.71 6.88,10.52 0.67,16.73 0.67,47.65 2.68,49.66 14.26,49.66 15.55,48.37 15.55,47.89 15.88,47.57 v15.88,47.5
  Bottom 0.381: v15.88,47.5 15.88,44.7 v15.62,44.45
VCC  (via drill 0.4)
  Top 0.292: IC4.8 8.89,43.3 9.53,43.94 v9.91,43.94 | IC1.14 19.45,39.77 18.29,38.61 15.62,38.61 15.37,38.35 C1.2 | v26.67,42.67 26.64,42.64 26.07,43.21 IC1.24 | IC1.34 23.45,49.19 24.64,50.37 24.64,51.18 24.26,51.56 | 17.14,52.45 17.14,51.29 17.26,51.18 17.26,50 17.72,49.54 18.15,49.54 18.45,49.24 IC1.44
  Top 0.381: C16.2 C17.2 26.54,12.32 | D3.1 D4.1 | R42.2 38.54,4.51 Q5.2 38.54,7.55 v38.86,7.87 | R40.2 42.23,4.51 Q4.2 42.23,7.55 v42.55,7.87 | D9.1 v10.79,27.18 | D5.1 v13.08,27.18 | R4.1 C1.2 C2.2 16,35.81 16,34.16 | 16,34.16 v16,33.53 | IC2.1 9.46,35.37 C7.2 9.65,34.54 10.03,34.16 16,34.16 | CON1.2 15.11,58.8 16.38,58.8 | 16.38,58.8 CON2.5 16.38,54.67 17.14,53.91 17.14,52.49 | R21.2 2.67,44.96 2.67,42.16 v2.92,41.91 | 17.14,52.45 17.14,52.49 | v31.75,7.87 31.73,7.89 31.73,8.89 | v26.54,32.26 v26.54,28.32 | 23.3,52.49 23.33,52.49 24.26,51.56 | 23.3,52.49 20.83,52.49 | 20.83,52.49 17.14,52.49 | R1.2 23.62,54.74 23.3,54.42 23.3,52.49 | R3.2 20.83,52.49 | C19.2 v5.33,41.27 | D7.1 v22.73,27.18 | CON2.3 20.19,58.8 16.38,58.8 | R36.1 60.77,9.14 58.3,11.61 54.41,11.61 v53.98,11.18
  Top 0.635: Q2.3 v48.64,10.54 | v6.35,24.89 v10.79,24.89
  Top 0.762: D4.1 31.73,8.89 31.73,11.06 30.48,12.32 26.54,12.32 19.18,12.32 13.08,18.41 8.05,18.41 2.95,23.52 2.95,24.87 v2.92,24.89 2.92,37.85 v3.05,37.97 | v7.24,52.83 7.24,52.07 8.68,50.63 13.54,50.63 14.99,52.07 v14.99,52.96
  Bottom 0.381: 5.33,41.91 v2.92,41.91 1.52,41.91 | 5.33,41.91 6.22,41.91 8.26,43.94 v9.91,43.94 | v5.33,41.27 5.33,41.91 | v26.67,42.67 27.18,42.67 27.43,42.42 27.43,36.96 27.09,36.61 25.07,36.61 24.6,36.14 24.6,35.48 25.07,35.02 26.63,35.02 26.85,34.8 26.85,34.26 26.43,33.85 26.43,32.7 26.54,32.59 v26.54,32.26 | v48.64,10.54 48.86,10.32 48.86,10.21 49.33,9.74 51.67,9.74 52.12,10.2 52.99,10.2 v53.98,11.18
  Bottom 0.635: v31.75,7.87 v38.86,7.87 v42.55,7.87 45.21,10.54 v48.64,10.54 | 16,27.18 v13.08,27.18 v10.79,27.18 v10.79,24.89 | v26.54,28.32 25.4,27.18 v22.73,27.18 16,27.18 | v16,33.53 16,27.18 | v2.92,24.89 v6.35,24.89
  Bottom 0.762: v7.24,52.83 3.43,52.83 1.52,50.93 1.52,41.91 1.52,39.5 v3.05,37.97 | v14.99,52.96 15.88,53.85 15.88,55.88 16.38,56.39 CON2.5
VEXT  (via drill 0.4)
  Top 0.889: v51.18,11.43 52.03,11.43 53.59,9.87 53.59,7.75 54.39,6.95 54.39,1.94 53.47,1.02 21.59,1.02 21.08,1.52 21.08,4.7 20.57,5.21 D2.2
  Bottom 0.889: v51.18,11.43 46.9,15.71 CON5.8
(copper drawn outside any net)
  shapes: Bottom area x2

### Text on the board
bNames: CON5 | DIN | AIN+ | D3.3V | A3.3V | GND | VIN | AIN- | DOUT